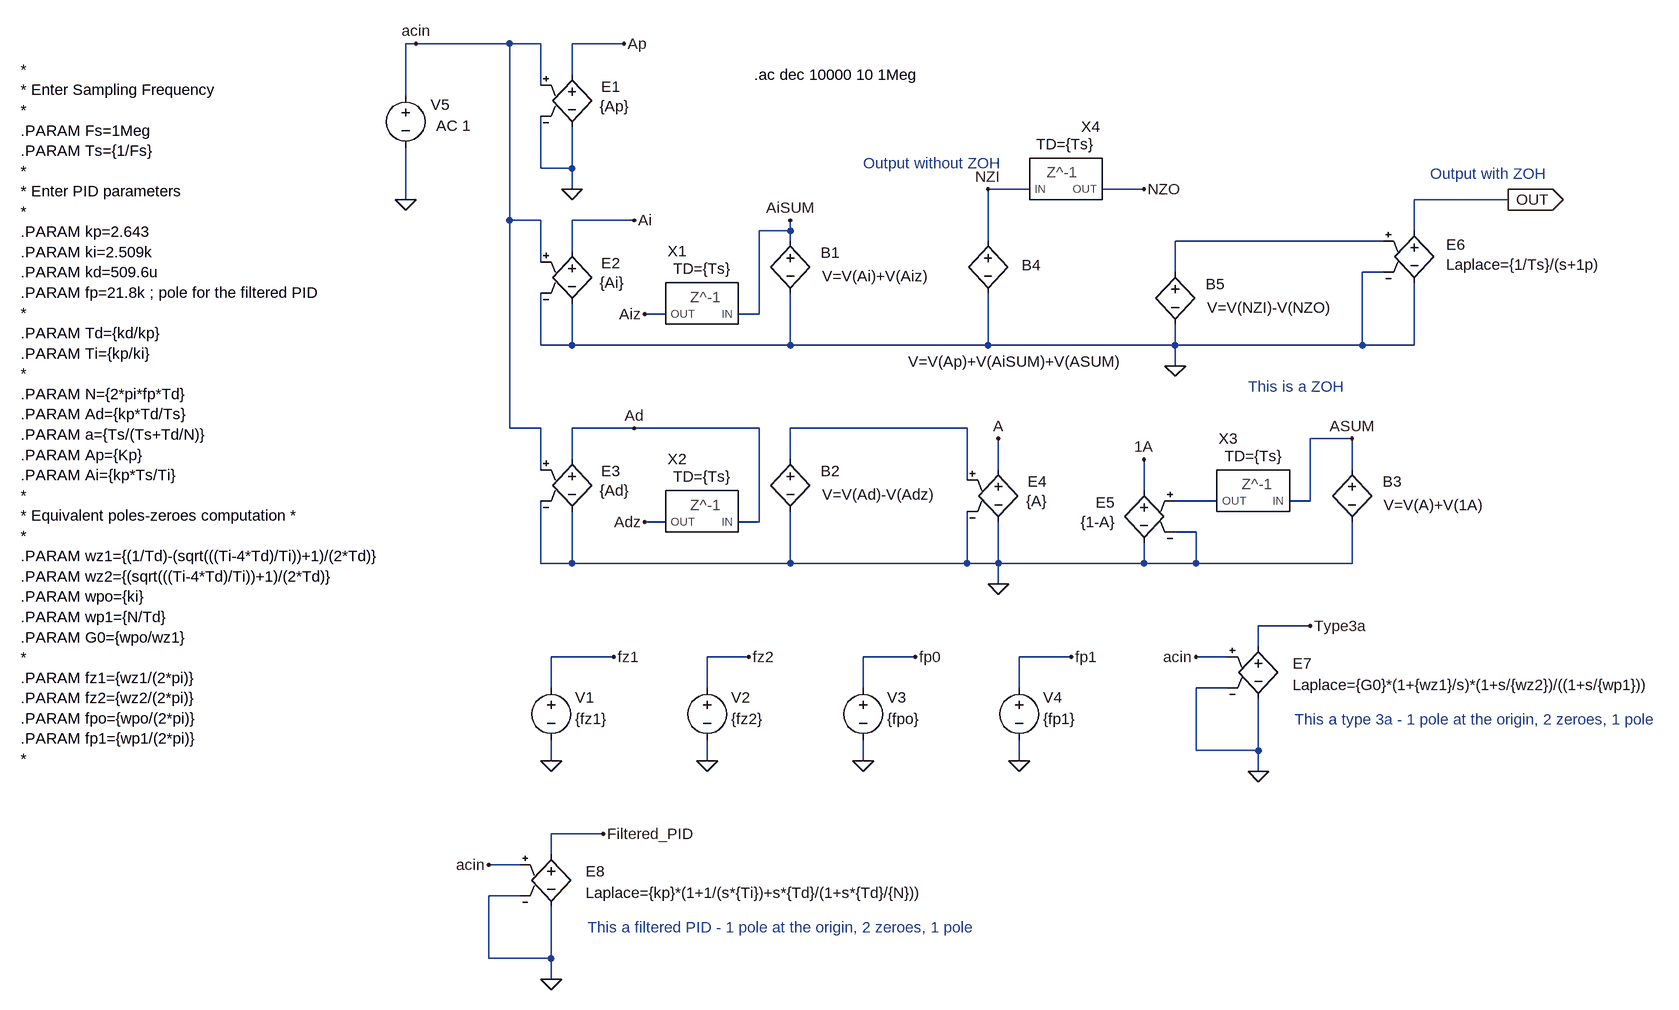
[diagram p0: schematic PID Digital - delay lines.asc]
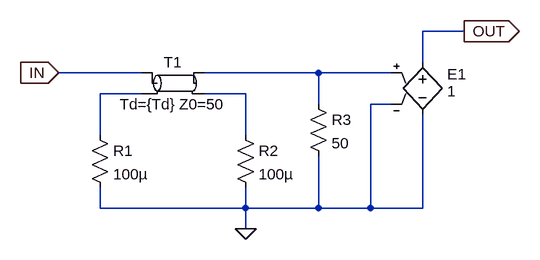
[diagram p1: sub-circuit zminus1.asc]
PID Digital - delay lines.asc, the LTspice schematic file:
Version 4
SHEET 1 2012 1492
WIRE -144 32 -160 32
WIRE 0 32 -144 32
WIRE 48 32 0 32
WIRE 176 32 96 32
WIRE 96 80 96 32
WIRE 48 96 48 32
WIRE -160 112 -160 32
WIRE 48 224 48 144
WIRE 96 224 96 160
WIRE 96 224 48 224
WIRE 96 256 96 224
WIRE 800 256 736 256
WIRE 976 256 912 256
WIRE -160 272 -160 192
WIRE 1536 272 1392 272
WIRE 0 304 0 32
WIRE 48 304 0 304
WIRE 192 304 96 304
WIRE 432 320 432 304
WIRE 432 320 384 320
WIRE 1392 320 1392 272
WIRE 432 336 432 320
WIRE 736 336 736 256
WIRE 1344 336 1024 336
WIRE 96 352 96 304
WIRE 48 368 48 304
WIRE 1024 384 1024 336
WIRE 1344 384 1312 384
WIRE 240 448 208 448
WIRE 384 448 384 320
WIRE 384 448 352 448
WIRE 48 496 48 416
WIRE 96 496 96 432
WIRE 96 496 48 496
WIRE 432 496 432 416
WIRE 432 496 96 496
WIRE 736 496 736 416
WIRE 736 496 432 496
WIRE 1024 496 1024 464
WIRE 1024 496 736 496
WIRE 1312 496 1312 384
WIRE 1312 496 1024 496
WIRE 1392 496 1392 400
WIRE 1392 496 1312 496
WIRE 1024 528 1024 496
WIRE 0 624 0 304
WIRE 48 624 0 624
WIRE 192 624 96 624
WIRE 384 624 192 624
WIRE 704 624 432 624
WIRE 1296 640 1232 640
WIRE 96 672 96 624
WIRE 432 672 432 624
WIRE 48 688 48 624
WIRE 752 688 752 640
WIRE 1296 688 1296 640
WIRE 704 704 704 624
WIRE 976 720 976 672
WIRE 1088 736 1024 736
WIRE 1232 736 1232 640
WIRE 1232 736 1200 736
WIRE 240 768 208 768
WIRE 384 768 384 624
WIRE 384 768 352 768
WIRE 1056 784 1024 784
WIRE 48 832 48 736
WIRE 96 832 96 752
WIRE 96 832 48 832
WIRE 432 832 432 752
WIRE 432 832 96 832
WIRE 704 832 704 752
WIRE 704 832 432 832
WIRE 752 832 752 768
WIRE 752 832 704 832
WIRE 976 832 976 800
WIRE 976 832 752 832
WIRE 1056 832 1056 784
WIRE 1056 832 976 832
WIRE 1296 832 1296 768
WIRE 1296 832 1056 832
WIRE 752 864 752 832
WIRE 1232 928 1152 928
WIRE 1152 960 1152 928
WIRE 160 976 64 976
WIRE 368 976 304 976
WIRE 624 976 544 976
WIRE 864 976 784 976
WIRE 1104 976 1056 976
WIRE 64 1024 64 976
WIRE 304 1024 304 976
WIRE 544 1024 544 976
WIRE 784 1024 784 976
WIRE 1104 1024 1056 1024
WIRE 1056 1120 1056 1024
WIRE 1152 1120 1152 1040
WIRE 1152 1120 1056 1120
WIRE 64 1136 64 1104
WIRE 304 1136 304 1104
WIRE 544 1136 544 1104
WIRE 784 1136 784 1104
WIRE 1152 1152 1152 1120
WIRE 144 1248 64 1248
WIRE 64 1280 64 1248
WIRE 16 1296 -32 1296
WIRE 16 1344 -32 1344
WIRE -32 1440 -32 1344
WIRE 64 1440 64 1360
WIRE 64 1440 -32 1440
WIRE 64 1472 64 1440
FLAG 96 256 0
FLAG 208 448 Aiz
FLAG 192 304 Ai
FLAG 432 304 AiSUM
FLAG 176 32 Ap
FLAG 208 768 Adz
FLAG 192 624 Ad
FLAG 752 864 0
FLAG 752 640 A
FLAG 1296 640 ASUM
FLAG 976 672 1A
FLAG 1536 272 OUT
IOPIN 1536 272 Out
FLAG 1024 528 0
FLAG 736 256 NZI
FLAG 976 256 NZO
FLAG 160 976 fz1
FLAG 64 1136 0
FLAG 368 976 fz2
FLAG 304 1136 0
FLAG 624 976 fp0
FLAG 544 1136 0
FLAG 864 976 fp1
FLAG 784 1136 0
FLAG -160 272 0
FLAG 1152 1152 0
FLAG 1232 928 Type3a
FLAG 1056 976 acin
FLAG -144 32 acin
FLAG 64 1472 0
FLAG 144 1248 Filtered_PID
FLAG -32 1296 acin
DATAFLAG 64 976 ""
DATAFLAG 304 976 ""
DATAFLAG 544 976 ""
DATAFLAG 784 976 ""
SYMBOL e 96 64 R0
WINDOW 0 45 34 Left 2
WINDOW 3 43 64 Left 2
SYMATTR InstName E1
SYMATTR Value {Ap}
SYMBOL e 96 336 R0
WINDOW 0 45 34 Left 2
WINDOW 3 43 64 Left 2
SYMATTR InstName E2
SYMATTR Value {Ai}
SYMBOL e 96 656 R0
WINDOW 0 45 34 Left 2
WINDOW 3 43 64 Left 2
SYMATTR InstName E3
SYMATTR Value {Ad}
SYMBOL Zminus1 304 448 R180
WINDOW 39 7 85 Bottom 2
WINDOW 0 46 112 Bottom 2
SYMATTR SpiceLine TD={Ts}
SYMATTR InstName X1
SYMBOL bv 432 320 R0
WINDOW 0 47 34 Left 2
WINDOW 3 49 70 Left 2
SYMATTR InstName B1
SYMATTR Value V=V(Ai)+V(Aiz)
SYMBOL Zminus1 304 768 R180
WINDOW 39 7 85 Bottom 2
WINDOW 0 46 112 Bottom 2
SYMATTR SpiceLine TD={Ts}
SYMATTR InstName X2
SYMBOL bv 432 656 R0
WINDOW 0 47 34 Left 2
WINDOW 3 49 70 Left 2
SYMATTR InstName B2
SYMATTR Value V=V(Ad)-V(Adz)
SYMBOL e 752 672 R0
WINDOW 0 45 34 Left 2
WINDOW 3 43 64 Left 2
SYMATTR InstName E4
SYMATTR Value {A}
SYMBOL e 976 704 M0
WINDOW 0 45 34 Left 2
WINDOW 3 43 64 Left 2
SYMATTR InstName E5
SYMATTR Value {1-A}
SYMBOL Zminus1 1152 736 R180
WINDOW 39 7 85 Bottom 2
WINDOW 0 46 112 Bottom 2
SYMATTR SpiceLine TD={Ts}
SYMATTR InstName X3
SYMBOL bv 1296 672 R0
WINDOW 0 47 34 Left 2
WINDOW 3 49 70 Left 2
SYMATTR InstName B3
SYMATTR Value V=V(A)+V(1A)
SYMBOL bv 736 320 R0
WINDOW 0 52 53 Left 2
WINDOW 3 -123 201 Left 2
SYMATTR InstName B4
SYMATTR Value V=V(Ap)+V(AiSUM)+V(ASUM)
SYMBOL bv 1024 368 R0
WINDOW 0 47 34 Left 2
WINDOW 3 49 70 Left 2
SYMATTR InstName B5
SYMATTR Value V=V(NZI)-V(NZO)
SYMBOL e 1392 304 R0
WINDOW 0 49 37 Left 2
WINDOW 3 49 68 Left 2
SYMATTR InstName E6
SYMATTR Value Laplace={1/Ts}/(s+1p)
SYMBOL Zminus1 848 256 M180
WINDOW 39 7 85 Bottom 2
WINDOW 0 46 112 Bottom 2
SYMATTR SpiceLine TD={Ts}
SYMATTR InstName X4
SYMBOL voltage 64 1008 R0
WINDOW 0 37 30 Left 2
WINDOW 3 37 63 Left 2
SYMATTR InstName V1
SYMATTR Value {fz1}
SYMBOL voltage 304 1008 R0
WINDOW 0 37 30 Left 2
WINDOW 3 37 63 Left 2
SYMATTR InstName V2
SYMATTR Value {fz2}
SYMBOL voltage 544 1008 R0
WINDOW 0 37 30 Left 2
WINDOW 3 37 63 Left 2
WINDOW 123 0 0 Left 0
WINDOW 39 0 0 Left 0
SYMATTR InstName V3
SYMATTR Value {fpo}
SYMBOL voltage 784 1008 R0
WINDOW 0 37 30 Left 2
WINDOW 3 37 63 Left 2
SYMATTR InstName V4
SYMATTR Value {fp1}
SYMBOL voltage -160 96 R0
WINDOW 0 39 30 Left 2
WINDOW 123 47 62 Left 2
WINDOW 39 0 0 Left 0
SYMATTR InstName V5
SYMATTR Value ""
SYMATTR Value2 AC 1
SYMBOL e 1152 944 R0
WINDOW 0 53 42 Left 2
WINDOW 3 53 75 Left 2
SYMATTR InstName E7
SYMATTR Value Laplace={G0}*(1+{wz1}/s)*(1+s/{wz2})/((1+s/{wp1}))
SYMBOL e 64 1264 R0
WINDOW 0 53 42 Left 2
WINDOW 3 53 75 Left 2
SYMATTR InstName E8
SYMATTR Value Laplace={kp}*(1+1/(s*{Ti})+s*{Td}/(1+s*{Td}/{N}))
TEXT 1136 560 Left 2 ;This is a ZOH
TEXT -752 72 Left 2 !*\n* Enter Sampling Frequency\n*\n.PARAM Fs=1Meg\n.PARAM Ts={1/Fs}\n*\n* Enter PID parameters\n*\n.PARAM kp=2.643\n.PARAM ki=2.509k\n.PARAM kd=509.6u\n.PARAM fp=21.8k ; pole for the filtered PID\n*\n.PARAM Td={kd/kp}\n.PARAM Ti={kp/ki}\n*\n.PARAM N={2*pi*fp*Td}\n.PARAM Ad={kp*Td/Ts}\n.PARAM a={Ts/(Ts+Td/N)}\n.PARAM Ap={Kp}\n.PARAM Ai={kp*Ts/Ti}\n*\n* Equivalent poles-zeroes computation *\n*\n.PARAM wz1={(1/Td)-(sqrt(((Ti-4*Td)/Ti))+1)/(2*Td)}\n.PARAM wz2={(sqrt(((Ti-4*Td)/Ti))+1)/(2*Td)}\n.PARAM wpo={ki}\n.PARAM wp1={N/Td}\n.PARAM G0={wpo/wz1}\n*\n.PARAM fz1={wz1/(2*pi)}\n.PARAM fz2={wz2/(2*pi)}\n.PARAM fpo={wpo/(2*pi)}\n.PARAM fp1={wp1/(2*pi)}\n*
TEXT 376 80 Left 2 !.ac dec 10000 10 1Meg
TEXT 1208 1072 Left 2 ;This a type 3a - 1 pole at the origin, 2 zeroes, 1 pole
TEXT 544 216 Left 2 ;Output without ZOH
TEXT 1416 232 Left 2 ;Output with ZOH
TEXT 120 1392 Left 2 ;This a filtered PID - 1 pole at the origin, 2 zeroes, 1 pole

zminus1.asc, the sub-circuit schematic file:
Version 4
SHEET 1 880 680
WIRE 624 80 560 80
WIRE 560 128 560 80
WIRE 128 144 0 144
WIRE 400 144 224 144
WIRE 512 144 400 144
WIRE 128 176 64 176
WIRE 288 176 224 176
WIRE 400 192 400 144
WIRE 512 192 480 192
WIRE 64 240 64 176
WIRE 288 240 288 176
WIRE 64 352 64 320
WIRE 288 352 288 320
WIRE 288 352 64 352
WIRE 400 352 400 272
WIRE 400 352 288 352
WIRE 480 352 480 192
WIRE 480 352 400 352
WIRE 560 352 560 208
WIRE 560 352 480 352
WIRE 288 384 288 352
FLAG 624 80 OUT
IOPIN 624 80 Out
FLAG 0 144 IN
IOPIN 0 144 In
FLAG 288 384 0
SYMBOL tline 176 160 R0
SYMATTR InstName T1
SYMATTR Value Td={Td} Z0=50
SYMBOL res 48 224 R0
SYMATTR InstName R1
SYMATTR Value 100µ
SYMBOL res 272 224 R0
SYMATTR InstName R2
SYMATTR Value 100µ
SYMBOL res 384 176 R0
SYMATTR InstName R3
SYMATTR Value 50
SYMBOL e 560 112 R0
WINDOW 0 38 34 Left 2
WINDOW 3 38 60 Left 2
SYMATTR InstName E1
SYMATTR Value 1

The netlist it stands for:
* PID Digital - delay lines.asc
E1 Ap 0 acin 0 {Ap}
E2 Ai 0 acin 0 {Ai}
E3 Ad 0 acin 0 {Ad}
XX1 AiSUM Aiz zminus1 params: TD={Ts}
B1 AiSUM 0 V=V(Ai)+V(Aiz)
XX2 Ad Adz zminus1 params: TD={Ts}
B2 N002 0 V=V(Ad)-V(Adz)
E4 A 0 N002 0 {A}
E5 1A 0 N003 0 {1-A}
XX3 ASUM N003 zminus1 params: TD={Ts}
B3 ASUM 0 V=V(A)+V(1A)
B4 NZI 0 V=V(Ap)+V(AiSUM)+V(ASUM)
B5 N001 0 V=V(NZI)-V(NZO)
E6 OUT 0 N001 0 Laplace={1/Ts}/(s+1p)
XX4 NZI NZO zminus1 params: TD={Ts}
V1 fz1 0 {fz1}
V2 fz2 0 {fz2}
V3 fp0 0 {fpo}
V4 fp1 0 {fp1}
V5 acin 0 AC 1
E7 Type3a 0 acin 0 Laplace={G0}*(1+{wz1}/s)*(1+s/{wz2})/((1+s/{wp1}))
E8 Filtered_PID 0 acin 0 Laplace={kp}*(1+1/(s*{Ti})+s*{Td}/(1+s*{Td}/{N}))

* block symbol definitions
.subckt zminus1 IN OUT
T1 IN N002 N001 N003 Td={Td} Z0=50
R1 N002 0 100µ
R2 N003 0 100µ
R3 N001 0 50
E1 OUT 0 N001 0 1
.ends zminus1

* This is a ZOH
*
* Enter Sampling Frequency
*
.PARAM Fs=1Meg
.PARAM Ts={1/Fs}
*
* Enter PID parameters
*
.PARAM kp=2.643
.PARAM ki=2.509k
.PARAM kd=509.6u
.PARAM fp=21.8k ; pole for the filtered PID
*
.PARAM Td={kd/kp}
.PARAM Ti={kp/ki}
*
.PARAM N={2*pi*fp*Td}
.PARAM Ad={kp*Td/Ts}
.PARAM a={Ts/(Ts+Td/N)}
.PARAM Ap={Kp}
.PARAM Ai={kp*Ts/Ti}
*
* Equivalent poles-zeroes computation *
*
.PARAM wz1={(1/Td)-(sqrt(((Ti-4*Td)/Ti))+1)/(2*Td)}
.PARAM wz2={(sqrt(((Ti-4*Td)/Ti))+1)/(2*Td)}
.PARAM wpo={ki}
.PARAM wp1={N/Td}
.PARAM G0={wpo/wz1}
*
.PARAM fz1={wz1/(2*pi)}
.PARAM fz2={wz2/(2*pi)}
.PARAM fpo={wpo/(2*pi)}
.PARAM fp1={wp1/(2*pi)}
*
.ac dec 10000 10 1Meg
* This a type 3a - 1 pole at the origin, 2 zeroes, 1 pole
* Output without ZOH
* Output with ZOH
* This a filtered PID - 1 pole at the origin, 2 zeroes, 1 pole
.backanno
.end